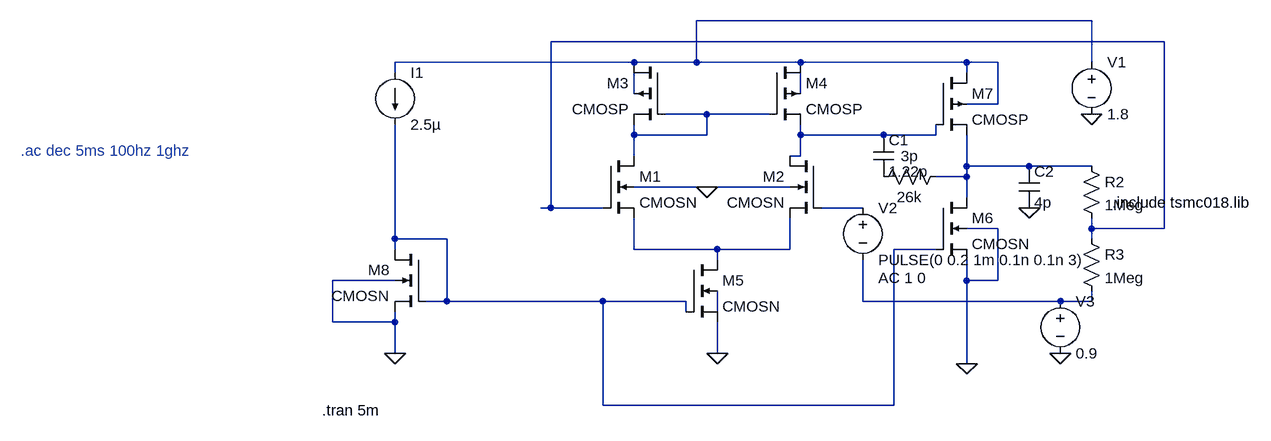
[diagram p0: schematic opamp.asc]
opamp.asc, the LTspice schematic file:
Version 4
SHEET 1 1268 680
WIRE 976 -80 368 -80
WIRE 1088 -48 144 -48
WIRE 272 -16 -96 -16
WIRE 368 -16 368 -80
WIRE 368 -16 272 -16
WIRE 528 -16 368 -16
WIRE 784 -16 528 -16
WIRE 832 -16 784 -16
WIRE 976 -16 976 -80
WIRE -96 0 -96 -16
WIRE 784 0 784 -16
WIRE 272 32 272 0
WIRE 528 32 528 0
WIRE 832 48 832 -16
WIRE 832 48 784 48
WIRE 384 64 320 64
WIRE 480 64 384 64
WIRE 272 96 272 80
WIRE 384 96 384 64
WIRE 384 96 272 96
WIRE 528 96 528 80
WIRE 656 96 528 96
WIRE 736 96 736 80
WIRE 736 96 656 96
WIRE 272 128 272 96
WIRE 528 128 528 96
WIRE 528 128 512 128
WIRE 784 144 784 96
WIRE 864 144 784 144
WIRE 880 144 864 144
WIRE 976 144 880 144
WIRE 784 160 784 144
WIRE 784 160 736 160
WIRE 384 176 272 176
WIRE 512 176 384 176
WIRE 784 192 784 160
WIRE 144 208 144 -48
WIRE 144 208 128 208
WIRE 224 208 144 208
WIRE 624 208 560 208
WIRE 832 240 784 240
WIRE 976 240 976 224
WIRE 1088 240 1088 -48
WIRE 1088 240 976 240
WIRE -96 256 -96 80
WIRE -16 256 -96 256
WIRE 976 256 976 240
WIRE -96 272 -96 256
WIRE 272 272 272 224
WIRE 400 272 272 272
WIRE 512 272 512 224
WIRE 512 272 400 272
WIRE 736 272 672 272
WIRE 400 288 400 272
WIRE -96 320 -192 320
WIRE 784 320 784 288
WIRE 832 320 832 240
WIRE 832 320 784 320
WIRE -16 352 -16 256
WIRE -16 352 -48 352
WIRE 224 352 -16 352
WIRE 352 352 224 352
WIRE 624 352 624 288
WIRE 928 352 624 352
WIRE 976 352 976 336
WIRE 976 352 928 352
WIRE 352 368 352 352
WIRE 400 368 400 336
WIRE -192 384 -192 320
WIRE -96 384 -96 368
WIRE -96 384 -192 384
WIRE -96 432 -96 384
WIRE 400 432 400 384
WIRE 784 448 784 320
WIRE 224 512 224 352
WIRE 672 512 672 272
WIRE 672 512 224 512
FLAG 400 432 0
FLAG -96 432 0
FLAG 784 448 0
FLAG 384 176 0
FLAG 976 64 0
FLAG 880 208 0
FLAG 928 432 0
DATAFLAG 400 272 ""
DATAFLAG 864 144 ""
SYMBOL cmosn 224 128 R0
SYMATTR InstName M1
SYMATTR Value2 l=1080n w=18u
SYMBOL cmosn 560 128 M0
SYMATTR InstName M2
SYMATTR Value2 l=1080n w=18u
SYMBOL cmosp 320 -16 M0
SYMATTR InstName M3
SYMATTR Value2 l=1080n w=5.1u
SYMBOL cmosp 480 -16 R0
SYMATTR InstName M4
SYMATTR Value2 l=1080n w=5.1u
SYMBOL cmosn 352 288 R0
SYMATTR InstName M5
SYMATTR Value2 l=900n w=7.8u
SYMBOL cmosn 736 192 R0
SYMATTR InstName M6
SYMATTR Value2 l=180n w=1.2u
SYMBOL cmosp 736 0 R0
SYMATTR InstName M7
SYMATTR Value2 l=180n w=1.2u
SYMBOL current -96 0 R0
WINDOW 123 0 0 Left 2
WINDOW 39 0 0 Left 2
SYMATTR InstName I1
SYMATTR Value 2.5µ
SYMBOL cmosn -48 272 M0
SYMATTR InstName M8
SYMATTR Value2 l=900n w=900n
SYMBOL voltage 976 -32 R0
SYMATTR InstName V1
SYMATTR Value 1.8
SYMBOL cap 640 96 R0
SYMATTR InstName C1
SYMATTR Value 1.22p
SYMBOL cap 864 144 R0
SYMATTR InstName C2
SYMATTR Value 4p
SYMBOL res 752 144 R90
WINDOW 0 0 56 VBottom 2
WINDOW 3 32 56 VTop 2
SYMATTR InstName 3p
SYMATTR Value 26k
SYMBOL res 960 128 R0
SYMATTR InstName R2
SYMATTR Value 1Meg
SYMBOL res 960 240 R0
SYMATTR InstName R3
SYMATTR Value 1Meg
SYMBOL voltage 624 192 R0
WINDOW 123 24 124 Left 2
WINDOW 39 0 0 Left 2
SYMATTR Value2 AC 1 0
SYMATTR InstName V2
SYMATTR Value PULSE(0 0.2 1m 0.1n 0.1n 3)
SYMBOL voltage 928 336 R0
WINDOW 123 0 0 Left 2
WINDOW 39 0 0 Left 2
SYMATTR InstName V3
SYMATTR Value 0.9
TEXT 1008 200 Left 2 !.include tsmc018.lib
TEXT -208 520 Left 2 !.tran 5m
TEXT -672 120 Left 2 ;.ac dec 5ms 100hz 1ghz

The netlist it stands for:
* opamp.asc
M1 N005 N002 N010 0 CMOSN l=1080n w=18u
M2 N006 N008 N010 0 CMOSN l=1080n w=18u
M3 N001 N005 N005 N003 CMOSP l=1080n w=5.1u
M4 N001 N005 N006 N004 CMOSP l=1080n w=5.1u
M5 N010 N009 0 N012 CMOSN l=900n w=7.8u
M6 N007 N009 0 0 CMOSN l=180n w=1.2u
M7 N001 N006 N007 N001 CMOSP l=180n w=1.2u
I1 N001 N009 2.5µ
M8 N009 N009 0 0 CMOSN l=900n w=900n
V1 N001 0 1.8
C1 N006 P001 1.22p
C2 N007 0 4p
R§3p N007 P001 26k
R2 N007 N002 1Meg
R3 N002 N011 1Meg
V2 N008 N011 PULSE(0 0.2 1m 0.1n 0.1n 3) AC 1 0
V3 N011 0 0.9
.model NMOS NMOS
.model PMOS PMOS
.lib standard.mos
.include tsmc018.lib
.tran 5m
* .ac dec 5ms 100hz 1ghz
.backanno
.end